# Altium schematic sheet PIC32MZ.SchDoc
size A3; SheetNumber: 2; SheetTotal: 8
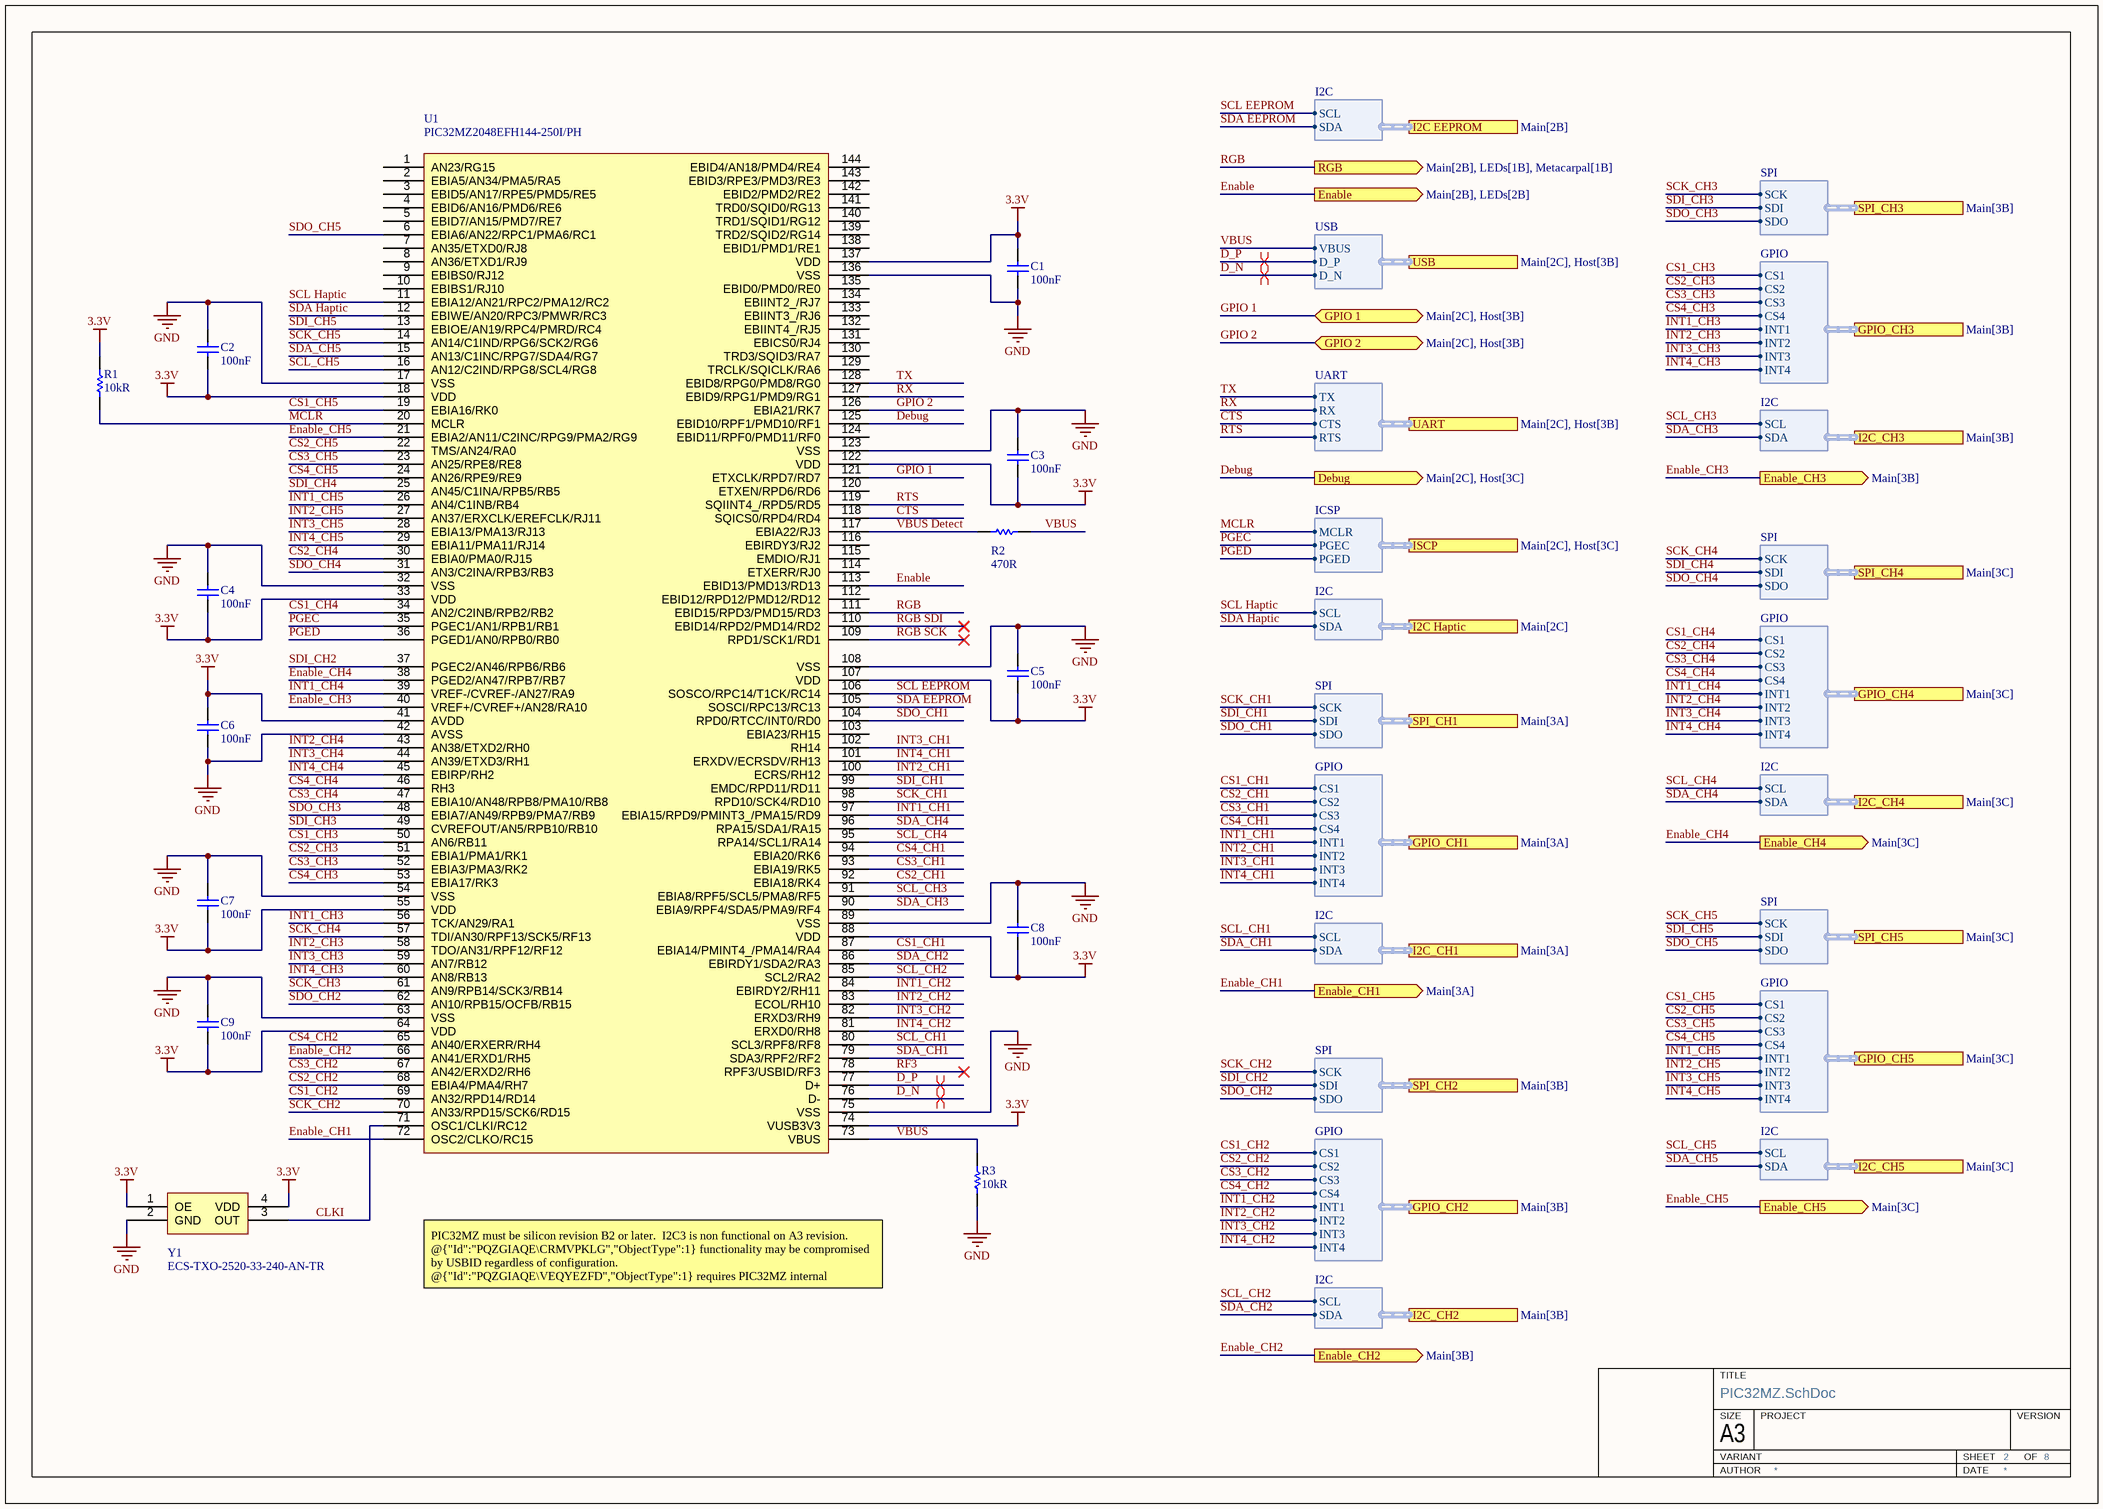
[diagram p0: PIC32MZ.SchDoc]

## Parts
C1  100nF  [Capacitor 0402]
C2  100nF  [Capacitor 0402]
C3  100nF  [Capacitor 0402]
C4  100nF  [Capacitor 0402]
C5  100nF  [Capacitor 0402]
C6  100nF  [Capacitor 0402]
C7  100nF  [Capacitor 0402]
C8  100nF  [Capacitor 0402]
C9  100nF  [Capacitor 0402]
R1  10kR  [Resistor 0402]
R2  470R  [Resistor 0402]
R3  10kR  [Resistor 0402]
U1  PIC32MZ2048EFH144-250I/PH  [TQFP-144 0.4mm]
Y1  ECS-TXO-2520-33-240-AN-TR  [ECS 2x2.5mm]

## Ports
Debug (out, see Main[2C], Host[3C]), Enable (out, see Main[2B], LEDs[2B]), Enable_CH1 (out, see Main[3A]), Enable_CH2 (out, see Main[3B]), Enable_CH3 (out, see Main[3B]), Enable_CH4 (out, see Main[3C]), Enable_CH5 (out, see Main[3C]), GPIO 1 (bidir, see Main[2C], Host[3B]), GPIO 2 (bidir, see Main[2C], Host[3B]), GPIO_CH1 (harness GPIO, see Main[3A]), GPIO_CH2 (harness GPIO, see Main[3B]), GPIO_CH3 (harness GPIO, see Main[3B]), GPIO_CH4 (harness GPIO, see Main[3C]), GPIO_CH5 (harness GPIO, see Main[3C]), I2C EEPROM (harness I2C, see Main[2B]), I2C Haptic (harness I2C, see Main[2C]), I2C_CH1 (harness I2C, see Main[3A]), I2C_CH2 (harness I2C, see Main[3B]), I2C_CH3 (harness I2C, see Main[3B]), I2C_CH4 (harness I2C, see Main[3C]), I2C_CH5 (harness I2C, see Main[3C]), ISCP (harness ICSP, see Main[2C], Host[3C]), RGB (out, see Main[2B], LEDs[1B], Metacarpal[1B]), SPI_CH1 (harness SPI, see Main[3A]), SPI_CH2 (harness SPI, see Main[3B]), SPI_CH3 (harness SPI, see Main[3B]), SPI_CH4 (harness SPI, see Main[3C]), SPI_CH5 (harness SPI, see Main[3C]), UART (harness UART, see Main[2C], Host[3B]), USB (harness USB, see Main[2C], Host[3B])

## Harnesses
I2C: SCL, SDA
SPI: SCK, SDI, SDO
GPIO: CS1, CS2, CS3, CS4, INT1, INT2, INT3, INT4
UART: TX, RX, CTS, RTS
USB: VBUS, D_P, D_N
ICSP: MCLR, PGEC, PGED

## Nets
3.3V: C1.2 C2.1 C3.1 C4.1 C5.1 C6.2 C7.1 C8.1 C9.1 R1.2 U1.18(VDD) U1.33(VDD) U1.41(AVDD) U1.55(VDD) U1.64(VDD) U1.74(VUSB3V3) U1.88(VDD) U1.107(VDD) U1.122(VDD) U1.137(VDD) Y1.1(OE) Y1.4(VDD)
GND: C1.1 C2.2 C3.2 C4.2 C5.2 C6.1 C7.2 C8.2 C9.2 R3.1 U1.17(VSS) U1.32(VSS) U1.42(AVSS) U1.54(VSS) U1.63(VSS) U1.75(VSS) U1.89(VSS) U1.108(VSS) U1.123(VSS) U1.136(VSS) Y1.2(GND)
CLKI: U1.71(OSC1/CLKI/RC12) Y1.3(OUT)
CS1_CH1: U1.87(EBIA14/PMINT4_/PMA14/RA4) ; port GPIO_CH1.CS1
CS1_CH2: U1.69(AN32/RPD14/RD14) ; port GPIO_CH2.CS1
CS1_CH3: U1.50(AN6/RB11) ; port GPIO_CH3.CS1
CS1_CH4: U1.34(AN2/C2INB/RPB2/RB2) ; port GPIO_CH4.CS1
CS1_CH5: U1.19(EBIA16/RK0) ; port GPIO_CH5.CS1
CS2_CH1: U1.92(EBIA18/RK4) ; port GPIO_CH1.CS2
CS2_CH2: U1.68(EBIA4/PMA4/RH7) ; port GPIO_CH2.CS2
CS2_CH3: U1.51(EBIA1/PMA1/RK1) ; port GPIO_CH3.CS2
CS2_CH4: U1.30(EBIA0/PMA0/RJ15) ; port GPIO_CH4.CS2
CS2_CH5: U1.22(TMS/AN24/RA0) ; port GPIO_CH5.CS2
CS3_CH1: U1.93(EBIA19/RK5) ; port GPIO_CH1.CS3
CS3_CH2: U1.67(AN42/ERXD2/RH6) ; port GPIO_CH2.CS3
CS3_CH3: U1.52(EBIA3/PMA3/RK2) ; port GPIO_CH3.CS3
CS3_CH4: U1.47(EBIA10/AN48/RPB8/PMA10/RB8) ; port GPIO_CH4.CS3
CS3_CH5: U1.23(AN25/RPE8/RE8) ; port GPIO_CH5.CS3
CS4_CH1: U1.94(EBIA20/RK6) ; port GPIO_CH1.CS4
CS4_CH2: U1.65(AN40/ERXERR/RH4) ; port GPIO_CH2.CS4
CS4_CH3: U1.53(EBIA17/RK3) ; port GPIO_CH3.CS4
CS4_CH4: U1.46(RH3) ; port GPIO_CH4.CS4
CS4_CH5: U1.24(AN26/RPE9/RE9) ; port GPIO_CH5.CS4
CTS: U1.118(SQICS0/RPD4/RD4) ; port UART.CTS
D_N: U1.76(D-) ; port USB.D_N
D_P: U1.77(D+) ; port USB.D_P
Debug: U1.125(EBID10/RPF1/PMD10/RF1) ; port Debug
Enable: U1.113(EBID13/PMD13/RD13) ; port Enable
Enable_CH1: U1.72(OSC2/CLKO/RC15) ; port Enable_CH1
Enable_CH2: U1.66(AN41/ERXD1/RH5) ; port Enable_CH2
Enable_CH3: U1.40(VREF+/CVREF+/AN28/RA10) ; port Enable_CH3
Enable_CH4: U1.38(PGED2/AN47/RPB7/RB7) ; port Enable_CH4
Enable_CH5: U1.21(EBIA2/AN11/C2INC/RPG9/PMA2/RG9) ; port Enable_CH5
GPIO 1: U1.121(ETXCLK/RPD7/RD7) ; port GPIO 1
GPIO 2: U1.126(EBIA21/RK7) ; port GPIO 2
INT1_CH1: U1.97(EBIA15/RPD9/PMINT3_/PMA15/RD9) ; port GPIO_CH1.INT1
INT1_CH2: U1.84(EBIRDY2/RH11) ; port GPIO_CH2.INT1
INT1_CH3: U1.56(TCK/AN29/RA1) ; port GPIO_CH3.INT1
INT1_CH4: U1.39(VREF-/CVREF-/AN27/RA9) ; port GPIO_CH4.INT1
INT1_CH5: U1.26(AN4/C1INB/RB4) ; port GPIO_CH5.INT1
INT2_CH1: U1.100(ECRS/RH12) ; port GPIO_CH1.INT2
INT2_CH2: U1.83(ECOL/RH10) ; port GPIO_CH2.INT2
INT2_CH3: U1.58(TDO/AN31/RPF12/RF12) ; port GPIO_CH3.INT2
INT2_CH4: U1.43(AN38/ETXD2/RH0) ; port GPIO_CH4.INT2
INT2_CH5: U1.27(AN37/ERXCLK/EREFCLK/RJ11) ; port GPIO_CH5.INT2
INT3_CH1: U1.102(RH14) ; port GPIO_CH1.INT3
INT3_CH2: U1.82(ERXD3/RH9) ; port GPIO_CH2.INT3
INT3_CH3: U1.59(AN7/RB12) ; port GPIO_CH3.INT3
INT3_CH4: U1.44(AN39/ETXD3/RH1) ; port GPIO_CH4.INT3
INT3_CH5: U1.28(EBIA13/PMA13/RJ13) ; port GPIO_CH5.INT3
INT4_CH1: U1.101(ERXDV/ECRSDV/RH13) ; port GPIO_CH1.INT4
INT4_CH2: U1.81(ERXD0/RH8) ; port GPIO_CH2.INT4
INT4_CH3: U1.60(AN8/RB13) ; port GPIO_CH3.INT4
INT4_CH4: U1.45(EBIRP/RH2) ; port GPIO_CH4.INT4
INT4_CH5: U1.29(EBIA11/PMA11/RJ14) ; port GPIO_CH5.INT4
MCLR: R1.1 U1.20(MCLR) ; port ISCP.MCLR
PGEC: U1.35(PGEC1/AN1/RPB1/RB1) ; port ISCP.PGEC
PGED: U1.36(PGED1/AN0/RPB0/RB0) ; port ISCP.PGED
RF3: U1.78(RPF3/USBID/RF3)
RGB: U1.111(EBID15/RPD3/PMD15/RD3) ; port RGB
RGB SCK: U1.109(RPD1/SCK1/RD1)
RGB SDI: U1.110(EBID14/RPD2/PMD14/RD2)
RTS: U1.119(SQIINT4_/RPD5/RD5) ; port UART.RTS
RX: U1.127(EBID9/RPG1/PMD9/RG1) ; port UART.RX
SCK_CH1: U1.98(RPD10/SCK4/RD10) ; port SPI_CH1.SCK
SCK_CH2: U1.70(AN33/RPD15/SCK6/RD15) ; port SPI_CH2.SCK
SCK_CH3: U1.61(AN9/RPB14/SCK3/RB14) ; port SPI_CH3.SCK
SCK_CH4: U1.57(TDI/AN30/RPF13/SCK5/RF13) ; port SPI_CH4.SCK
SCK_CH5: U1.14(AN14/C1IND/RPG6/SCK2/RG6) ; port SPI_CH5.SCK
SCL EEPROM: U1.106(SOSCO/RPC14/T1CK/RC14) ; port I2C EEPROM.SCL
SCL Haptic: U1.11(EBIA12/AN21/RPC2/PMA12/RC2) ; port I2C Haptic.SCL
SCL_CH1: U1.80(SCL3/RPF8/RF8) ; port I2C_CH1.SCL
SCL_CH2: U1.85(SCL2/RA2) ; port I2C_CH2.SCL
SCL_CH3: U1.91(EBIA8/RPF5/SCL5/PMA8/RF5) ; port I2C_CH3.SCL
SCL_CH4: U1.95(RPA14/SCL1/RA14) ; port I2C_CH4.SCL
SCL_CH5: U1.16(AN12/C2IND/RPG8/SCL4/RG8) ; port I2C_CH5.SCL
SDA EEPROM: U1.105(SOSCI/RPC13/RC13)
SDA Haptic: U1.12(EBIWE/AN20/RPC3/PMWR/RC3)
SDA_CH1: U1.79(SDA3/RPF2/RF2)
SDA_CH2: U1.86(EBIRDY1/SDA2/RA3)
SDA_CH3: U1.90(EBIA9/RPF4/SDA5/PMA9/RF4)
SDA_CH4: U1.96(RPA15/SDA1/RA15)
SDA_CH5: U1.15(AN13/C1INC/RPG7/SDA4/RG7)
SDI_CH1: U1.99(EMDC/RPD11/RD11) ; port SPI_CH1.SDI
SDI_CH2: U1.37(PGEC2/AN46/RPB6/RB6) ; port SPI_CH2.SDI
SDI_CH3: U1.49(CVREFOUT/AN5/RPB10/RB10) ; port SPI_CH3.SDI
SDI_CH4: U1.25(AN45/C1INA/RPB5/RB5) ; port SPI_CH4.SDI
SDI_CH5: U1.13(EBIOE/AN19/RPC4/PMRD/RC4) ; port SPI_CH5.SDI
SDO_CH1: U1.104(RPD0/RTCC/INT0/RD0) ; port SPI_CH1.SDO
SDO_CH2: U1.62(AN10/RPB15/OCFB/RB15) ; port SPI_CH2.SDO
SDO_CH3: U1.48(EBIA7/AN49/RPB9/PMA7/RB9) ; port SPI_CH3.SDO
SDO_CH4: U1.31(AN3/C2INA/RPB3/RB3) ; port SPI_CH4.SDO
SDO_CH5: U1.6(EBIA6/AN22/RPC1/PMA6/RC1) ; port SPI_CH5.SDO
TX: U1.128(EBID8/RPG0/PMD8/RG0) ; port UART.TX
VBUS: R2.1 R3.2 U1.73(VBUS) ; port USB.VBUS
VBUS Detect: R2.2 U1.117(EBIA22/RJ3)

Not connected (* = marked no-connect by the designer): U1 1(AN23/RG15) 2(EBIA5/AN34/PMA5/RA5) 3(EBID5/AN17/RPE5/PMD5/RE5) 4(EBID6/AN16/PMD6/RE6) 5(EBID7/AN15/PMD7/RE7) 7(AN35/ETXD0/RJ8) 8(AN36/ETXD1/RJ9) 9(EBIBS0/RJ12) 10(EBIBS1/RJ10) 103(EBIA23/RH15) 112(EBID12/RPD12/PMD12/RD12) 114(ETXERR/RJ0) 115(EMDIO/RJ1) 116(EBIRDY3/RJ2) 120(ETXEN/RPD6/RD6) 124(EBID11/RPF0/PMD11/RF0) 129(TRCLK/SQICLK/RA6) 130(TRD3/SQID3/RA7) 131(EBICS0/RJ4) 132(EBIINT4_/RJ5) 133(EBIINT3_/RJ6) 134(EBIINT2_/RJ7) 135(EBID0/PMD0/RE0) 138(EBID1/PMD1/RE1) 139(TRD2/SQID2/RG14) 140(TRD1/SQID1/RG12) 141(TRD0/SQID0/RG13) 142(EBID2/PMD2/RE2) 143(EBID3/RPE3/PMD3/RE3) 144(EBID4/AN18/PMD4/RE4)

## Layout directives
differential pair: D_N, D_P

## Notes on the sheet
- PIC32MZ must be silicon revision B2 or later.  I2C3 is non functional on A3 revision.
  @{"Id":"PQZGIAQE\CRMVPKLG","ObjectType":1} functionality may be compromised by USBID regardless of configuration.
  @{"Id":"PQZGIAQE\VEQYEZFD","ObjectType":1} requires PIC32MZ internal pull-down to ensure @{"Id":"QSPHDPUG\XVWCFEXP","ObjectType":1} is idle low.
  @{"Id":"PQZGIAQE\REOEHRRV","ObjectType":1} will output SCK1 regardless of PPS configuration.
- TITLE
- SIZE
- A3
- VARIANT
- PROJECT
- SHEET
- VERSION
- OF
- AUTHOR
- DATE

## Library data of the parts
C1-C9 = Capacitor
R1-R3 = Resistor
Y1 = Oscillator